# Altium schematic sheet Delay Line.SchDoc: Наименование
size A4; ApprovedBy: Утвердил; CheckedBy: Проверил; Author: Разработал; CompanyName: Организация; DrawnBy: Н.Контр; Engineer: Т.Контр; SheetNumber: 1; SheetTotal: 1; PageSetup: Record=PageOptions|CenterHorizontal=True|CenterVertical=True|PrintScale=0.94|XCorrection=1.00|YCorrection=1.00|PrintKind=1|BorderSize=5000000|LeftOffset=0|BottomOffset=0|Orientation=1|PaperLength=1000|PaperWidth=1000|Scale=100|PaperSource=7|PrintQuality=-4|MediaType=1|DitherType=10|PaperKind=A4|PrintScaleMode=1; DecimalNumber: Децимальный номер; HeadOfSector: Нач. сектора; MainDevice: Перв.примен.; Name: Наименование; DocumentName: Sheet1.SCHDOC
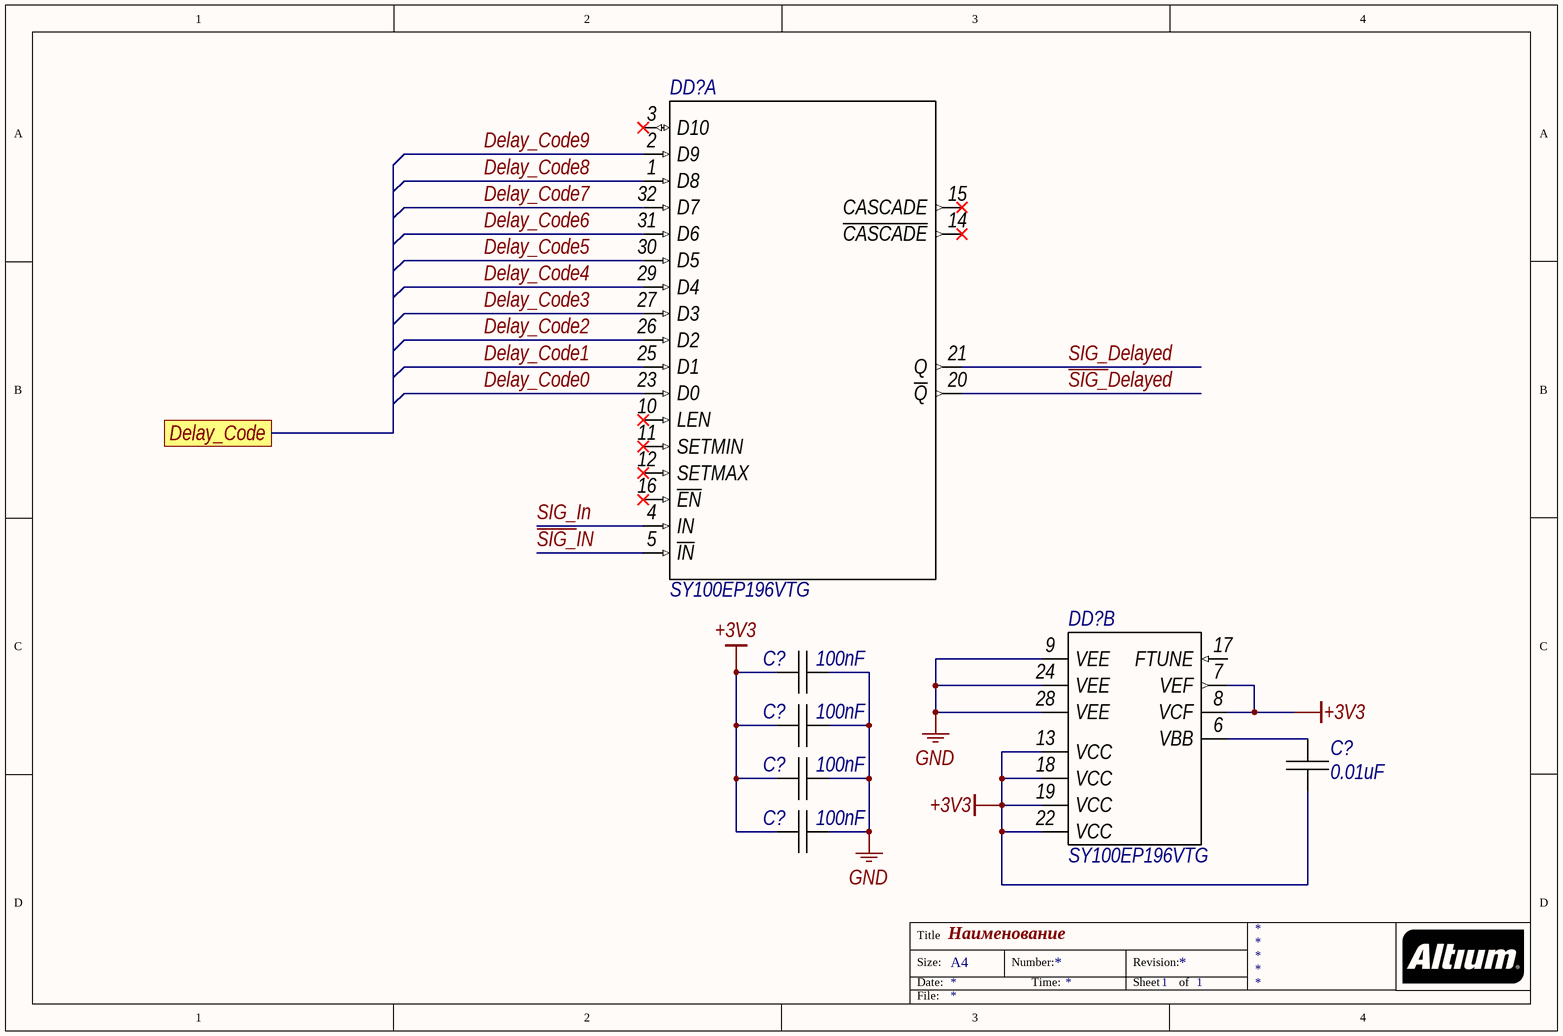
[diagram p0: Delay Line.SchDoc]

## Parts
(Parts that share a designator on the sheet are numbered #1, #2 ... from top to bottom, then left to right.)
C?#1  value 100nF  [CAP0402]  (hidden comment: 100nF *)
C?#2  value 100nF  [CAP0402]  (hidden comment: 100nF *)
C?#3  value 0.01uF  [CAP0402]  (hidden comment: 0.01uF *)
C?#4  value 100nF  [CAP0402]  (hidden comment: 100nF *)
C?#5  value 100nF  [CAP0402]  (hidden comment: 100nF *)
DD?#1  (no value)  [TQFP-32_N]  (part A of 2)
DD?#2  (no value)  [TQFP-32_N]  (part B of 2)

## Ports
Delay_Code

## Nets
+3V3: C?#1.2 C?#2.2 C?#3.2 C?#4.2 C?#5.2 DD?#2.7(VEF) DD?#2.8(VCF) DD?#2.13(VCC) DD?#2.18(VCC) DD?#2.19(VCC) DD?#2.22(VCC)
GND: C?#1.1 C?#2.1 C?#4.1 C?#5.1 DD?#2.9(VEE) DD?#2.24(VEE) DD?#2.28(VEE)
Delay_Code0: DD?#1.23(D0)
Delay_Code1: DD?#1.25(D1)
Delay_Code2: DD?#1.26(D2)
Delay_Code3: DD?#1.27(D3)
Delay_Code4: DD?#1.29(D4)
Delay_Code5: DD?#1.30(D5)
Delay_Code6: DD?#1.31(D6)
Delay_Code7: DD?#1.32(D7)
Delay_Code8: DD?#1.1(D8)
Delay_Code9: DD?#1.2(D9)
~{SIG_}Delayed: DD?#1.20(~{Q})
~{SIG_}IN: DD?#1.5(~{IN})
SIG_Delayed: DD?#1.21(Q)
SIG_In: DD?#1.4(IN)
NetC?#3_1: C?#3.1 DD?#2.6(VBB)

Not connected (* = marked no-connect by the designer): DD?#1 3(D10)* 10(LEN)* 11(SETMIN)* 12(SETMAX)* 14(~{CASCADE})* 15(CASCADE)* 16(~{EN})*; DD?#2 17(FTUNE)

## Notes on the sheet
- Title
- Size:
- Date:
- A4
- Number:
- Time:
- Revision:
- Sheet
- of
- File:

## Library data of the parts
C?#1-C?#5 = CAP0402: MntType: SMD; MSL: MSL 1; Package: =Footprint; RoHS: Comply; PartType: CHIP CERAMIC CAPACITOR; Pins: 2; BOMDescription: =MntType+' '+PartType+' '+Package+' '+Value+' '+Tolerance+' '+Voltage+' '+TempCoeff+' '+MPN; CFootprint: =Footprint; Voltage: *; Part Number: CAP0402; ClassName: Capacitor; ComponentLink1Description: Datasheet
DD?#1 DD?#2 = SY100EP196VTG: Manufacturer: Microchip; MntType: SMD; MPN: SY100EP196VTG; Part Number: SY100EP196VTG; MSL: MSL 1; Package: TQFP-32; RoHS: Comply; PartType: Delay; Pins: 32; BOMDescription: =MntType+' '+PartType+' '+Package+' '+Value+' '+Tolerance+' '+Voltage+' '+TempCoeff+' '+MPN; CFootprint: =Footprint; ComponentLink1Description: Datasheet; ComponentLink1URL: https://ww1.microchip.com/downloads/en/DeviceDoc/SY100EP196V-3.3V-5V-2.5GHz-Programmable-Delay-Chip-with-Fine-Tune-Control-DS20006520A.pdf